# Altium project BatteryControl.PrjPcb
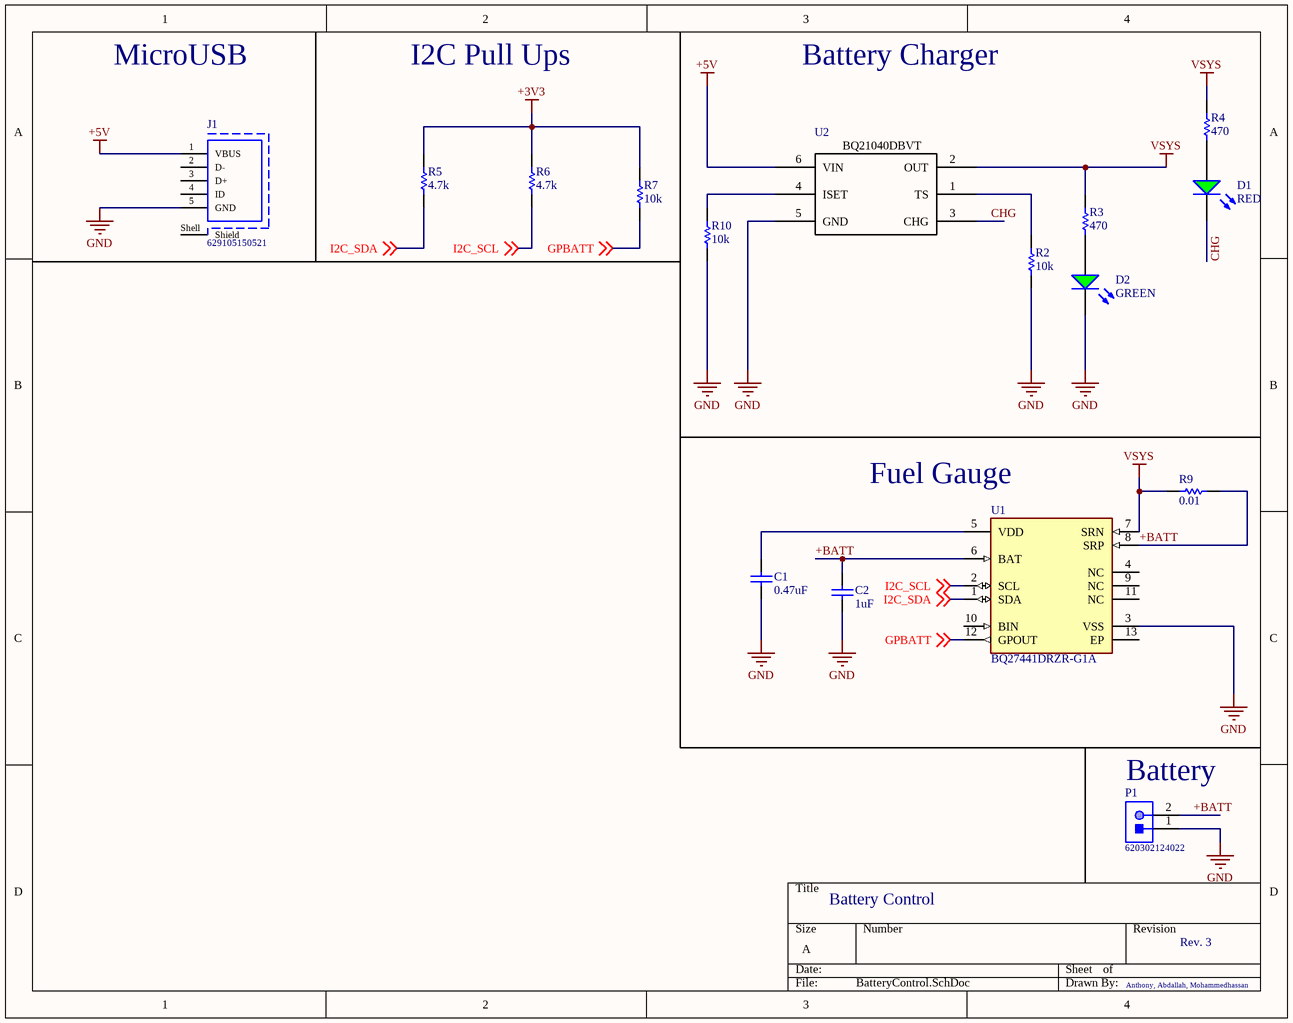
[diagram p0: BatteryControl.SchDoc]
1 sheet, 16 parts. Net scope: global (net labels, ports and power ports of the same name join across sheets).
Board file: BatteryControl.PcbDoc

## Sheet BatteryControl.SchDoc
size A

### Parts
C1  0.47uF  [CAPC2013X145X50LL20T25]
C2  1uF  [CAPC2013X145X50LL20T25]
D1  RED  [LUMX-SML-LX0603_V]
D2  GREEN  [LUMX-SML-LX0603_V]
J1  629105150521  [629105150521]
P1  620302124022  [620302124022]
R2  10k  [RESC2013X60X40ML20T25]
R3  470  [RESC2013X60X40ML20T25]
R4  470  [RESC2013X60X40ML20T25]
R5  4.7k  [RESC2013X60X40ML20T25]
R6  4.7k  [RESC2013X60X40ML20T25]
R7  10k  [RESC2013X60X40ML20T25]
R9  0.01  [RESC2013X60X40ML20T25]
R10  10k  [RESC2013X60X40ML20T25]
U1  BQ27441DRZR-G1A  [FP-DRZ0012A-MFG]
U2  Component_1  [BQ21040DBVT]  (value not drawn)

### Nets
+3V3: R5.2 R6.2 R7.2
+5V: J1.1(VBUS) U2.6(VIN)
GND: C1.1 C2.1 D2.2(K) J1.5(GND) P1.1 R2.1 R10.1 U1.3(VSS) U2.5(GND)
VSYS: R3.2 R4.2 R9.2 U1.7(SRN) U2.2(OUT)
+BATT: C2.2 P1.2 R9.1 U1.6(BAT) U1.8(SRP)
CHG: D1.2(K) U2.3(CHG)
GPBATT: R7.1 U1.12(GPOUT) ; off-sheet GPBATT
I2C_SCL: R6.1 U1.2(SCL) ; off-sheet I2C_SCL
I2C_SDA: R5.1 U1.1(SDA) ; off-sheet I2C_SDA
NetC1_2: C1.2 U1.5(VDD)
NetD1_1: D1.1(A) R4.1
NetD2_1: D2.1(A) R3.1
NetR2_2: R2.2 U2.1(TS)
NetR10_2: R10.2 U2.4(ISET)

Not connected (* = marked no-connect by the designer): J1 2(D-) 3(D+) 4(ID) Shell(Shield); U1 4(NC) 9(NC) 10(BIN) 11(NC) 13(EP)

### Notes on the sheet
- MicroUSB
- I2C Pull Ups
- Battery Charger
- (near U1) Fuel Gauge
- (near P1) Battery
- Battery Control
- Rev. 3
- Anthony, Abdallah, Mohammedhassan
- (in symbol Component_1) BQ21040DBVT

### Library data of the parts
C1 C2 = CMP-1036-04746-2: Manufacturer: Kemet; Part Number: C0805C105K4PACTU
D1 D2 = CMP-2000-07120-1: LED Green Diode, 18 mcd, 50 mW, -25 to 85 degC, 2-Pin SMD, RoHS, Tape and Reel; Manufacturer: Lumex; Part No: SML-LX0603GW-TR; Peak Wavelength: 565nm; Viewing Angle: 160; LED Material: GaP; COO: CN; Lens Appearance: ColorlessDiffused; Pin_Count: 2; Type: Uni-Color; Intensity: 18mcd; Number of LEDs: 1; Reverse Voltage: 5(Min)V; Supplier: Lumex; ECCN: EAR99; Packaging: TapeandReel; Supplier Standard Pack: 4,000; Mounting: SurfaceMount; Operating Temperature: -25to85C; Package Description: 2-Pin Surface Mount Device, Body 1.6 x 0.8 mm; Family: SML-LX0603GW; Lens Dimensions: 1x0.8x0.3mm; Dominant Wavelength: N/A; Package Reference: SML-LX00603; HTS: 8541402000; Mounting Technology: SurfaceMount; Datasheet Version: Rev. G, 09/2013; Manufacturer URL: http://www.lumexinstruments.com/; RoHS: Yes; Datasheet URL: http://www.lumex.com/content/files/ProductAttachment/SML-LX0603GW-TR.pdf; Supplier_Package: SMD; Color: Green; Dimension: 1.6x0.8x0.6mm
J1 = CMP-1502-03252-1: Micro USB 2.0 Type B Receptacle WR-COM, Horizontal, SMT, with Pegs, High Current at Pin 1 & Pin 5; Manufacturer: Wurth Elektronik; Contact Resistance: 30mOhm; Rated Current: 3A; Working Voltage: 30VAC; Package Reference: 629105150521; Mounting Technology: SMT; Connector Type: MicroUSB2.0TypeB; Operating Temperature: -40to85degC; Orientation: Horizontal; Manufacturer URL: http://www.we-online.de; Datasheet URL: https://katalog.we-online.de/em/datasheet/629105150521.pdf; Part Number: 629105150521; Packaging: TapeandReel; Gender: Receptacle; Publisher: WurthElektronik
P1 = CMP-1502-00660-1: Male Shrouded Header WR-WTB, SMT, Vertical, pitch 2 mm, 1 x 2 position; Manufacturer: Wurth Elektronik; Pitch: 2mm; Position: 1x2; Working Voltage: 100VAC; Contact Resistance: 20mOhm; Package Reference: 620302124022; Manufacturer URL: http://www.we-online.de; Gender: Male; Orientation: Vertical; Publisher: WurthElektronik; Mounting Technology: SMT; Operating Temperature: -25to85degC; Datasheet URL: https://katalog.we-online.de/em/datasheet/6203xx124022.pdf; Packaging: TapeandReel; Part Number: 620302124022
R2-R7 R9 R10 = CMP-2001-00644-1: Part Number: ERA6AEB472V; Manufacturer: Panasonic
U1 = CMP-04911-000008-1: IC BATT FUEL GAUGE LI-ION 12SON; Manufacturer: Texas Instruments; Number Of Cells: 1; Nominal Supply Current: 93uA; Max Supply Voltage: 4.5V; Standoff Height: 0mm; Min Supply Voltage: 2.45V; Output Voltage: 1.8V; Temperature Range High: +85°C; Temperature: -40°C to +85°C; Device Class L2: Power Management ICs; Device Class L1: Integrated Circuits (ICs); Lead Free: Yes; Height: 1mm; Package: DRZ0012A; Number Of Outputs: 1; ComponentLink2URL: http://www.ti.com/lit/gpn/bq27441-g1; Ambient Temperature Range High: +85°C; Category: IC; Manufacturer Part Number: BQ27441DRZR-G1A; Device Class L3: Battery Management; RoHS: TRUE; Octopart: https://octopart.com/bq27441drzr-g1a-texas+instruments-30555829; Ambient Temperature Range Low: -40°C; Automotive: No; Mouser Description: System-Side Impedance Track? Battery Fuel (Gas) Gauge 12-SON -40 to 85; Digikey Description: IC BATT FUEL GAUGE LI-ION 12SON; Temperature Range Low: -40°C; ComponentLink2Description: Datasheet